# Altium schematic sheet DIMMER.SchDoc
size A; SheetNumber: 4; SheetTotal: 5
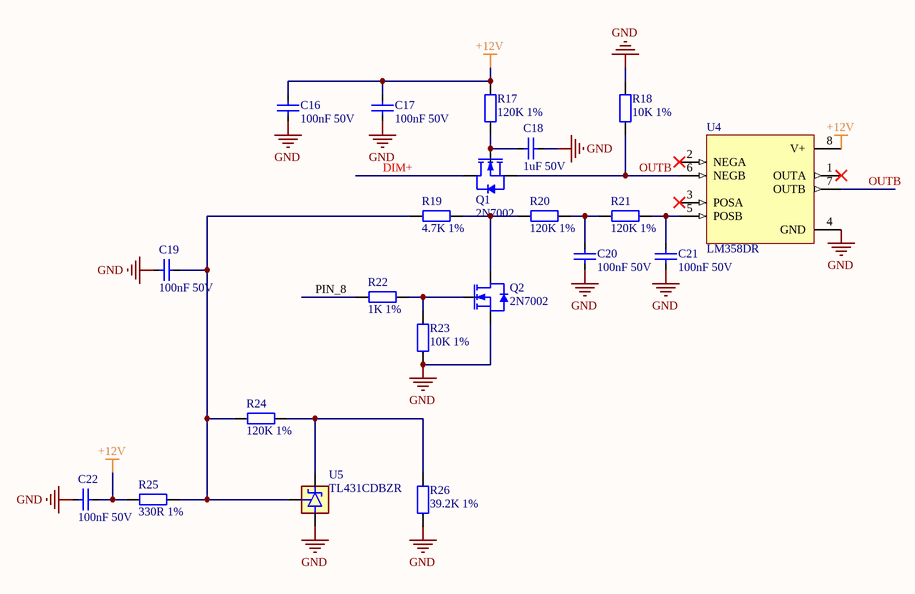
[diagram p0: DIMMER.SchDoc]

## Parts
C16  100nF 50V  [CAP_SMD_0805]
C17  100nF 50V  [CAP_SMD_0805]
C18  1uF 50V  [CAP_SMD_0805]
C19  100nF 50V  [CAP_SMD_0805]
C20  100nF 50V  [CAP_SMD_0805]
C21  100nF 50V  [CAP_SMD_0805]
C22  100nF 50V  [CAP_SMD_0805]
Q1  2N7002  [SOT-23-3]
Q2  2N7002  [SOT-23-3]
R17  120K 1%  [RES_SMD_0805]
R18  10K 1%  [RES_SMD_0805]
R19  4.7K 1%  [RES_SMD_0805]
R20  120K 1%  [RES_SMD_0805]
R21  120K 1%  [RES_SMD_0805]
R22  1K 1%  [RES_SMD_0805]
R23  10K 1%  [RES_SMD_0805]
R24  120K 1%  [RES_SMD_0805]
R25  330R 1%  [RES_SMD_0805]
R26  39.2K 1%  [RES_SMD_0805]
U4  LM358DR  [8 - SOIC]
U5  TL431CDBZR  [SOT-23-3]

## Nets
+12V: C16.2 C17.2 C22.2 R17.2 R25.1 U4.8(V+)
GND: C16.1 C17.1 C18.2 C19.1 C20.1 C21.1 C22.1 Q2.3(S) R18.2 R23.1 R26.1 U4.4(GND) U5.3(ANODE)
DIM+: Q1.2(D)
OUTB: Q1.3(S) R18.1 U4.6(NEGB) U4.7(OUTB)
PIN_8: R22.1
NetC18_1: C18.1 Q1.1(G) R17.1
NetC19_2: C19.2 R19.1 R24.1 R25.2 U5.2(REF)
NetC20_2: C20.2 R20.2 R21.1
NetC21_2: C21.2 R21.2 U4.5(POSB)
NetQ2_1: Q2.1(G) R22.2 R23.2
NetQ2_2: Q2.2(D) R19.2 R20.1
NetR24_2: R24.2 R26.2 U5.1(CATHODE)

Not connected (* = marked no-connect by the designer): U4 1(OUTA)* 2(NEGA)* 3(POSA)*

## Notes on the sheet
- (in symbol TL431CDBZR) /

## Library data of the parts
C16 C17 C19-C22 = C0805_MLCC_100nF_50V: 0.1 µF ±10% 50V Ceramic Capacitor X7R 0805 (2012 Metric); Manufacturer: YAGEO; Manufacture Part Number: CC0805KRX7R9BB104; Packaging: Cut Tape (CT); Link: https://www.digikey.cn/en/products/detail/yageo/CC0805KRX7R9BB104/302874; Price: $0.10
C18 = C0805_MLCC_1uF_50V: 1 µF ±10% 50V Ceramic Capacitor X7R 0805 (2012 Metric); Manufacturer: Samsung Electro-Mechanics; Manufacture Part Number: CL21B105KBFNNNG; Packaging: Cut Tape (CT); Link: https://www.digikey.cn/en/products/detail/samsung-electro-mechanics/CL21B105KBFNNNG/3894467; Price: $0.11
Q1 Q2 = 2N7002: N-Channel 60 V 115mA (Ta) 200mW (Ta) Surface Mount SOT-23-3; Manufacturer: onsemi; Manufacture Part Number: 2N7002; Packaging: Cut Tape (CT); Link: https://www.digikey.com/en/products/detail/onsemi/2N7002/244664; Price: $0.45
R17 R20 R21 R24 = R0805_120K: 120 kOhms ±1% 0.125W, 1/8W Chip Resistor 0805 (2012 Metric) Moisture Resistant Thick Film; Manufacturer: YAGEO; Manufacture Part Number: RC0805FR-07120KL; Packaging: Cut Tape (CT); Link: https://www.digikey.com/en/products/detail/yageo/RC0805FR-07120KL/727576; Price: $0.10
R18 R23 = R0805_10K: 10 kOhms ±1% 0.125W, 1/8W Chip Resistor 0805 (2012 Metric) Moisture Resistant Thick Film; Manufacturer: YAGEO; Manufacture Part Number: RC0805FR-0710KL; Packaging: Cut Tape (CT); Price: $0.10; Link: https://www.digikey.cn/en/products/detail/yageo/RC0805FR-0710KL/727535
R19 = R0805_4.7K: 4.7 kOhms ±1% 0.125W, 1/8W Chip Resistor 0805 (2012 Metric) Thick Film; Manufacturer: Vishay Dale; Manufacture Part Number: CRCW08054K70FKEAC; Packaging: Cut Tape (CT); Link: https://www.digikey.com/en/products/detail/vishay-dale/CRCW08054K70FKEAC/7928553; Price: $0.10
R22 = R0805_1K: 1 kOhms ±1% 0.125W, 1/8W Chip Resistor 0805 (2012 Metric) Moisture Resistant Thick Film; Manufacturer: YAGEO; Manufacture Part Number: 311-1.00KCRCT-ND; Packaging: Cut Tape (CT); Link: https://www.digikey.com/en/products/detail/yageo/RC0805FR-071KL/727444; Price: $0.10
R25 = R0805_330R: 330 Ohms ±1% 0.125W, 1/8W Chip Resistor 0805 (2012 Metric) Automotive AEC-Q200 Thick Film; Manufacturer: Stackpole Electronics Inc; Manufacture Part Number: RMCF0805FT330R; Packaging: Cut Tape (CT); Link: https://www.digikey.cn/en/products/detail/stackpole-electronics-inc/RMCF0805FT330R/1760484; Price: $0.10
R26 = R0805_39.2K: 39.2 kOhms ±1% 0.125W, 1/8W Chip Resistor 0805 (2012 Metric) Moisture Resistant Thick Film; Manufacturer: YAGEO; Manufacture Part Number: RC0805FR-0739K2L; Packaging: Cut Tape (CT); Link: https://www.digikey.com/en/products/detail/yageo/RC0805FR-0739K2L/727901; Price: $0.10
U4 = LM358DR: General Purpose Amplifier 2 Circuit 8-SOIC; Manufacturer: Texas Instruments; Manufacture Part Number: LM358DR; Packaging: Cut Tape (CT); Link: https://www.digikey.cn/en/products/detail/texas-instruments/LM358DR/276658; Price: $0.41
U5 = TL431CDBZR: Shunt Voltage Reference IC Adjustable 2.495V 36 VV ±2.2% 100 mA SOT-23-3; Manufacturer: Texas Instruments; Manufacture Part Number: TL431CDBZR; Packaging: Cut Tape (CT); Link: https://www.digikey.com/en/products/detail/texas-instruments/TL431CDBZR/686858; Price: $0.47